# EasyEDA Pro project ProDoc_MSP-LITO-G3507.epro

# Schematic Schematic1
Board Name: MSP-LITO-G3507; Create Date: 2025-07-21; Page Name: P1; Project Name: NUEDC TI-2025 Ctrller Pltform; Schematic Name: Schematic1; Update Date: 2025-07-24; Company: CQUPT; Drawed: WilliTourt; Page Size: A3; Reviewed: WilliTourt; Version: V1.0
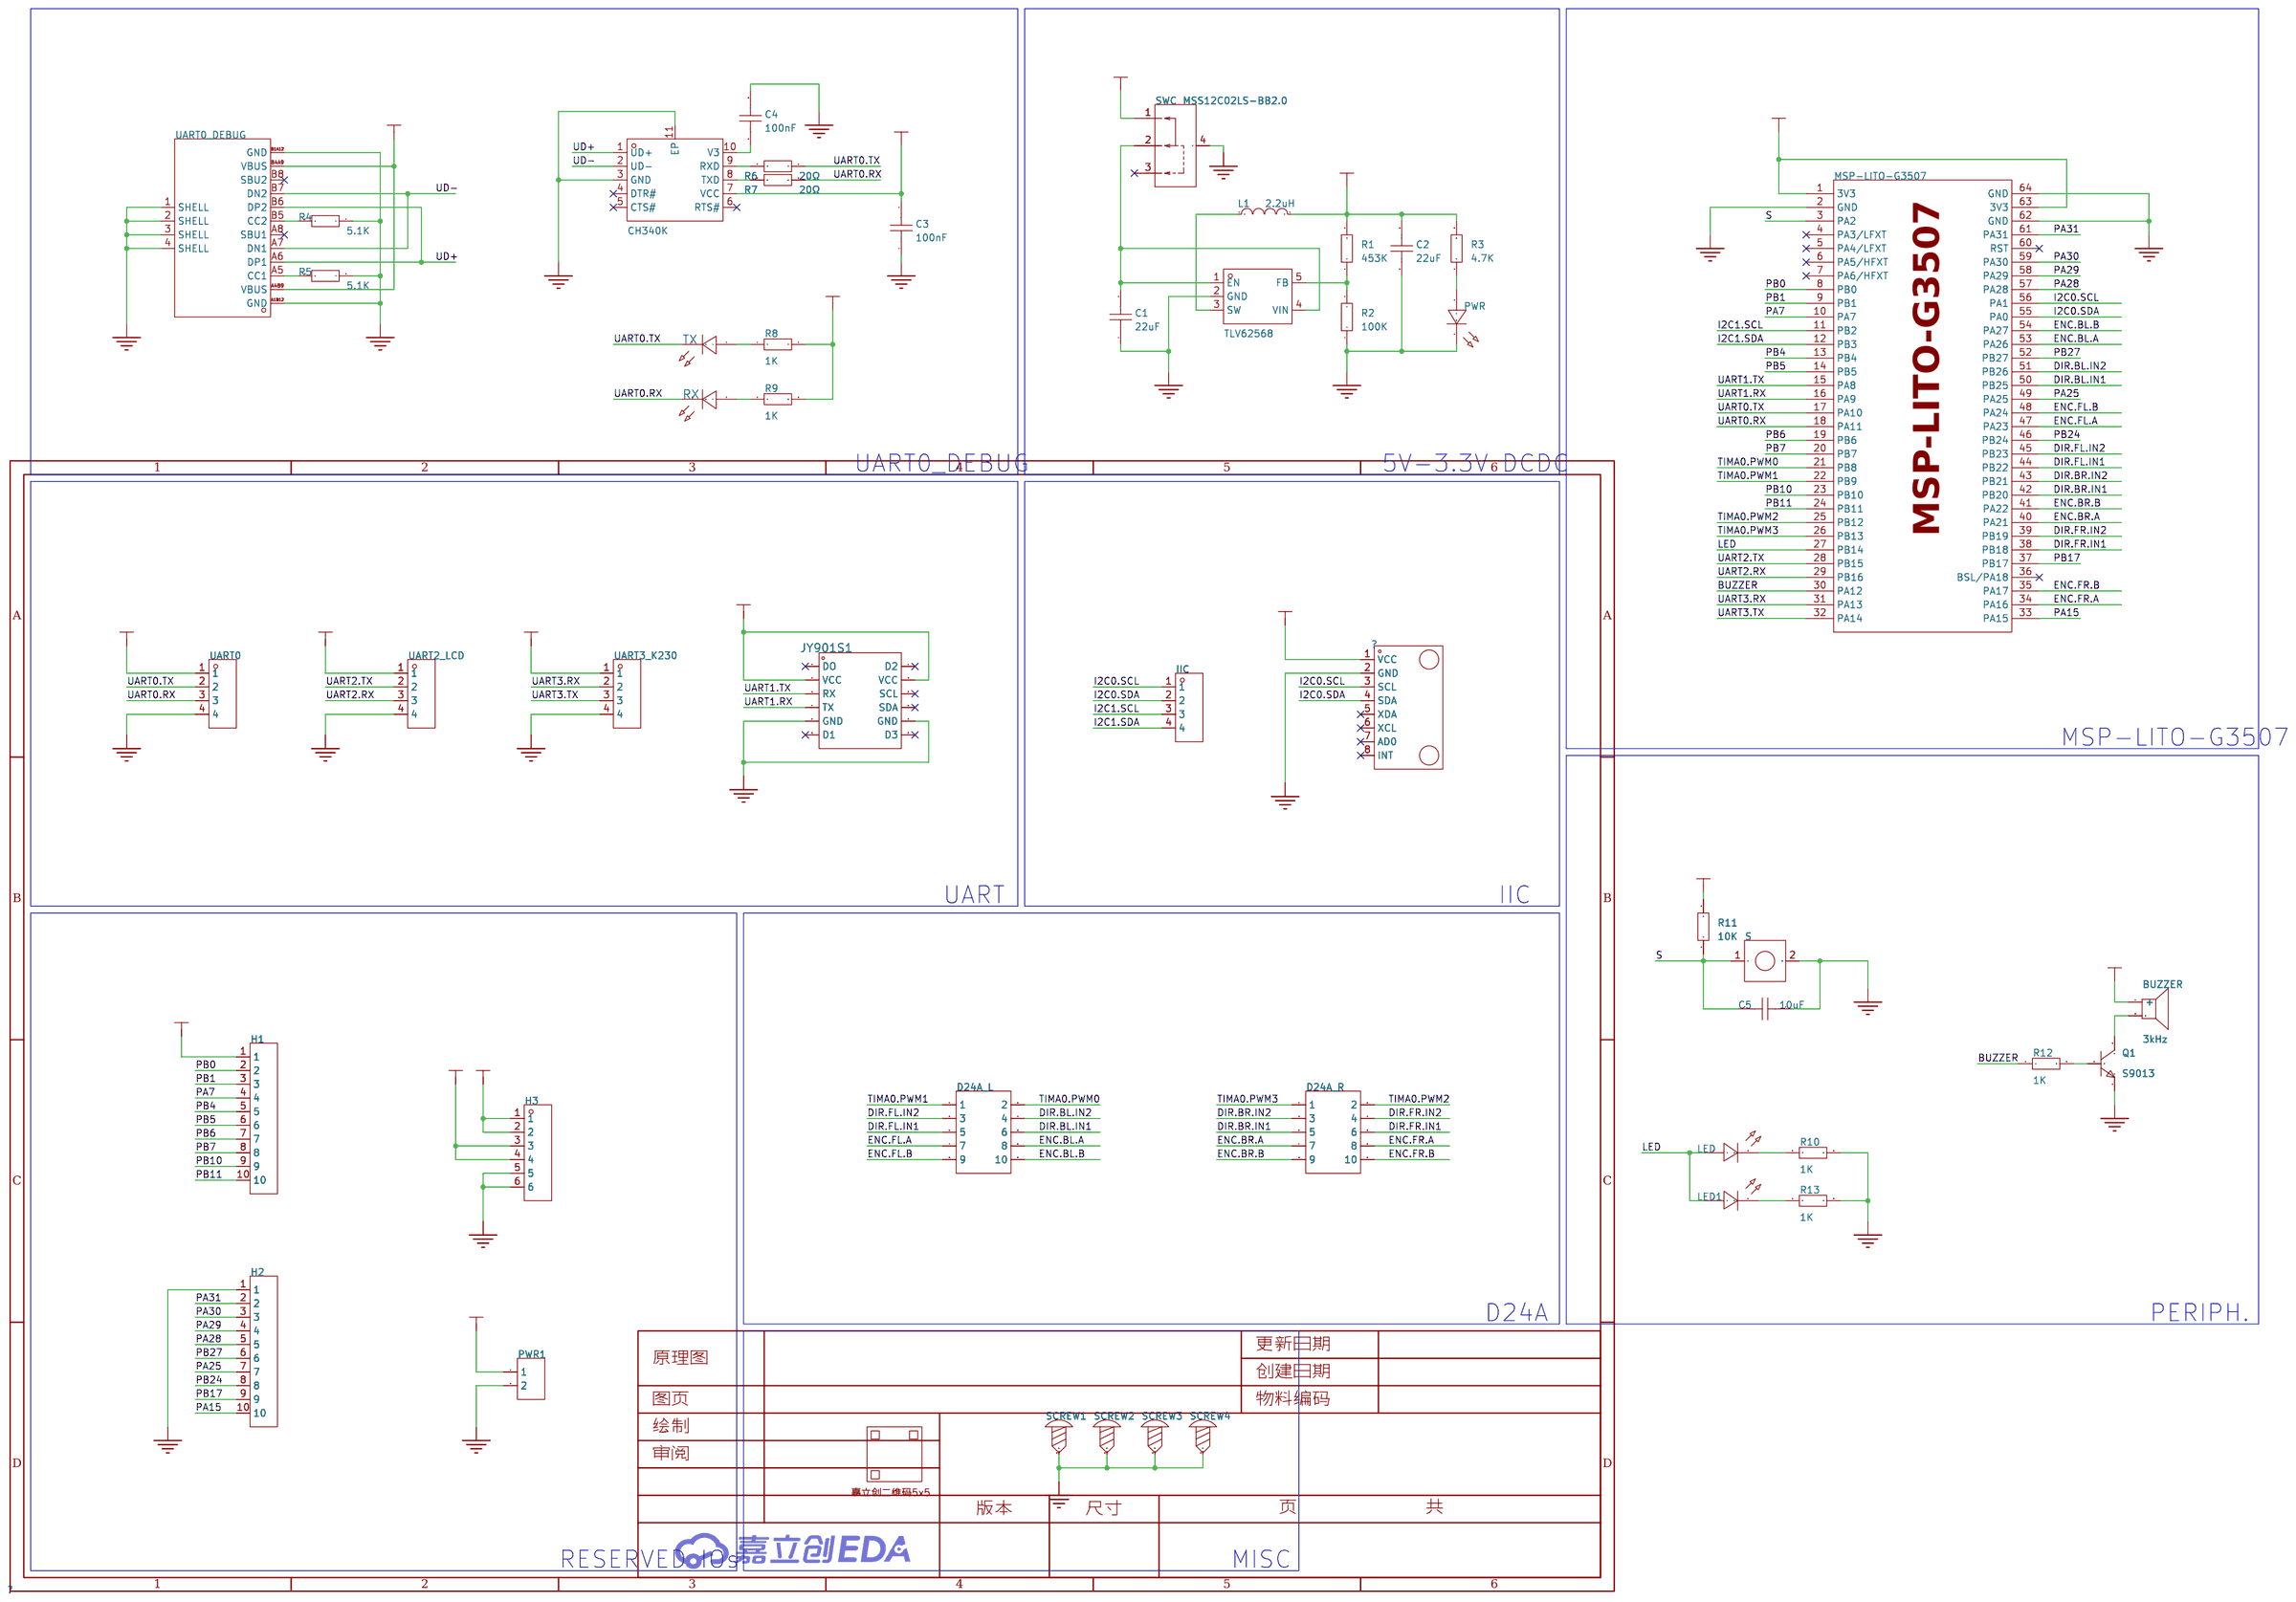
[diagram p0: schematic sheet]

## Parts
BUZZER  3kHz  [BUZ-SMD_L9.6-W9.6-LS10.0-R]
C1  22uF  [C0603]
C2  22uF  [C0603]
C3  100nF  [C0603]
C4  100nF  [C0603]
C5  10uF  [C0603]
CH340K  CH340K  [ESOP-10_L4.9-W3.9-P1.00-LS6.2-BL-EP]
D24A_L  -  [HDR-TH_10P-P2.54-V-F-R2-C5-S2.54]
D24A_R  -  [HDR-TH_10P-P2.54-V-F-R2-C5-S2.54]
H1  -  [HDR-TH_10P-P2.54-V-F]
H2  -  [HDR-TH_10P-P2.54-V-F]
H3  -  [HDR-TH_6P-P2.54-V-F]
IIC  -  [HDR-TH_4P-P2.54-V-F]
JY901S1  -  [JY901S]
L1  2.2uH  [IND-SMD_L3.0-W3.0_FNR30XXS]
LED  -  [LED0603]
LED1  -  [LED0603]
MPU6050  -  [MPU6050]
MSP-LITO-G3507  -  [MSP-LITO-G3507]
PWR  -  [LED0603]
PWR1  -  [HDR-TH_2P-P2.54-V-F]
Q1  S9013  [SOT-23-3_L2.9-W1.4-P1.90-LS2.6-BR]
QR  -  [JLC-QRCODE-5x5]
R1  453K  [R0603]
R2  100K  [R0603]
R3  4.7K  [R0603]
R4  5.1K  [R0603]
R5  5.1K  [R0603]
R6  20Ω  [R0603]
R7  20Ω  [R0603]
R8  1K  [R0603]
R9  1K  [R0603]
R10  1K  [R0603]
R11  10K  [R0603]
R12  1K  [R0603]
R13  1K  [R0603]
RX  -  [LED0603]
S  -  [6*6*5 硅胶开关]
SCREW1  -  [M3螺丝]
SCREW2  -  [M3螺丝]
SCREW3  -  [M3螺丝]
SCREW4  -  [M3螺丝]
SWC  MSS12C02LS-BB2.0  [SW-SMD_MSS12C02LS-HB2.0-1]
TLV62568  TLV62568DBVR  [SOT-23-5_L3.0-W1.7-P0.95-LS2.8-BR]
TX  -  [LED0603]
UART0  -  [HDR-TH_4P-P2.54-V-F]
UART0_DEBUG  Type-C-TOP_1  [USB-C-SMD_TYPE-C16PIN]
UART2_LCD  -  [HDR-TH_4P-P2.54-V-F]
UART3_K230  -  [HDR-TH_4P-P2.54-V-F]

## Library data of the parts
BUZZER = FUET-9650B-3V: 驱动方式:有源(内含驱动线路);构造类型:电磁式;频率:3kHz;声压(SPL):85dB;; LCSC Part Name: 电压 3V 频率 3KHZ; Supplier Part: C391032; Manufacturer: FUET(福声科技); Supplier Footprint: SMD,9.6x9.6mm; JLCPCB Part Class: 扩展库; Datasheet: https://atta.szlcsc.com/upload/public/pdf/source/20191031/C391032_DAAC75D3C9B9135EF0EA60697D179A21.pdf; Supplier: LCSC; Driver Circuitry: 有源(内含驱动线路); Technology: 电磁式; Voltage - Supply: 2V~5V; Sound Pressure Level(SPL): 85dB; Length: 9.6mm; Width: 9.6mm; Height: 5.5mm
C1-C5 = C0603: Supplier Footprint: 0603
CH340K = CH340K: 应用功能:USB转串口;接口协议:USB 2.0;通道数:-;数据速率:2Mbps;; LCSC Part Name: USB转串口芯片CH340; Supplier Part: C968586; Manufacturer: WCH(南京沁恒); Supplier Footprint: ESSOP-10-150mil-1mm; JLCPCB Part Class: 扩展库; Datasheet: https://atta.szlcsc.com/upload/public/pdf/source/20240313/C21A12AB66F63ABF8F8743FF13A35C95.pdf; Supplier: LCSC; Applications Function: USB转串口; Protocol: USB 2.0; Voltage - Supply: 3.3V；5V; Data Rate: 2Mbps; Operating Temperature: -20℃~+70℃
D24A_L D24A_R = HDR-F_2.54_2x5: Supplier Part: C92270; Supplier Footprint: 插件
H1 H2 = HDR-F_2.54_1x10P: Supplier Part: C2684744; Supplier Footprint: 插件
H3 = HDR-F_2.54_1x6P: Supplier Part: C40877; Supplier Footprint: 插件
IIC UART0 UART2_LCD UART3_K230 = HDR-F_2.54_1x4P: Supplier Part: C2718488; Supplier Footprint: 插件
JY901S1 = JY901S
L1 = FNR3015S2R2MT: 电感值:2.2uH;精度:±20%;额定电流:2A;饱和电流(Isat):2A;; LCSC Part Name: 2.2uH ±20% 2A; Supplier Part: C167747; Manufacturer: cjiang(长江微电); Supplier Footprint: SMD,3x3mm; JLCPCB Part Class: 扩展库; Datasheet: https://atta.szlcsc.com/upload/public/pdf/source/20190327/C167925_9EFF0AABC4CA629C2CC95961DBF7D39D.pdf; Supplier: LCSC; Tolerance: ±20%; Rated Current: 2A; Saturation Current (Isat): 2A; DC Resistance (DCR): 78mΩ
LED LED1 = LED0603-WHITE
MPU6050 = MPU6050
MSP-LITO-G3507 = MSP-LITO-G3507
PWR = LED0603-GREEN
PWR1 = HDR-F_2.54_1x2P: Supplier Part: C49661; Supplier Footprint: 插件
Q1 = S9013_C2836092: 晶体管类型:NPN;集电极电流(Ic):500mA;集射极击穿电压(Vceo):25V;功率(Pd):300mW;直流电流增益(hFE@Ic,Vce):120@50mA,1V;; LCSC Part Name: J3(J3表示丝印); Supplier Part: C2836092; Manufacturer: CBI(创基); Supplier Footprint: SOT-23; JLCPCB Part Class: 扩展库; Datasheet: https://atta.szlcsc.com/upload/public/pdf/source/20210621/C2836092_15188A6897D44309F7F2A6D715C57DA2.pdf; Supplier: LCSC; Transistor Type: NPN; Collector Current (Ic): 500mA; Collector-Emitter Breakdown Voltage (Vceo): 25V; Power Dissipation (Pd): 300mW; DC Current Gain (hFE@Ic,Vce): 120@50mA,1V; Transition Frequency (fT): 150MHz; Collector Cut-Off Current (Icbo): 100nA; Collector-Emitter Saturation Voltage (VCE(sat)@Ic,Ib): 600mV@500mA,50mA
QR = 嘉立创二维码5x5
R1-R13 = R0603: Supplier Footprint: 0603
RX TX = LED0603-ORANGE: Supplier Footprint: 0603
S = 6*6*5 硅胶开关
SCREW1-SCREW4 = M3螺丝: Supplier Footprint: 插件
SWC = MSS12C02LS-BB2.0: 电路结构:单刀双掷;安装方式:立贴;开关颜色:-;额定电流(DC):100mA;额定电压(DC):12V;额定电流(AC):-;额定电压(AC):-;机械寿命:1万次;; Supplier Part: C3008585; Manufacturer: SHOU HAN(首韩); Supplier Footprint: SMD; JLCPCB Part Class: 扩展库; Datasheet: https://atta.szlcsc.com/upload/public/pdf/source/20220429/8AEFBC67104491914BC5659DE1F359A3.pdf; Supplier: LCSC; Circuit: 单刀双掷; Pin Style: SMD接片; Switch Length: 6.65mm; Switch Width: 2.75mm; Switch Height: 1.4mm; Mounting Style: 立贴; Current Rating (DC): 100mA; Voltage Rating (DC): 12V; Mechanical Life: 1万次; Operating Temperature: -25℃~+70℃
TLV62568 = TLV62568DBVR: 功能类型:降压型;输出类型:可调;工作电压:2.5V~5.5V;输出电压:600mV~5.5V;输出电流:1A;; LCSC Part Name: 1A高效同步降压转换器; Supplier Part: C163219; Manufacturer: TI(德州仪器); Supplier Footprint: SOT-23-5; JLCPCB Part Class: 扩展库; Datasheet: https://www.ti.com/cn/lit/gpn/tlv62568; Supplier: LCSC; Function: 降压型; Output Type: 可调; Input Voltage: 2.5V~5.5V; Output Voltage: 600mV~5.5V; Output Current: 1A; Switching Frequency: 1.5MHz; Operating Temperature: -40℃~+125℃@(TJ); Synchronous Rectification: 是; Number of Outputs: 1; Topology: 降压式; Switch tube (built-in/external): 内置
UART0_DEBUG = Type-C-TOP_1: Supplier Part: C9900005857; Supplier Footprint: Type-C16P; JLCPCB Part Class: 扩展库; Supplier: LCSC; Check: false

## Nets
3V3: BUZZER.1(+) C2.2 C3.2 CH340K.7(VCC) H1.1 H3.3 H3.4 JY901S1.2(VCC) JY901S1.8(VCC) L1.2 MPU6050.1(VCC) MSP-LITO-G3507.1(3V3) MSP-LITO-G3507.63(3V3) R1.2 R3.2 R8.2 R9.2 R11.2 UART0.1 UART2_LCD.1 UART3_K230.1
5V: H3.1 H3.2 PWR1.1 SWC.1 UART0_DEBUG.A4B9(VBUS) UART0_DEBUG.B4A9(VBUS)
GND: C1.1 C2.1 C3.1 C4.2 C5.1 CH340K.3(GND) CH340K.11(EP) H2.1 H3.5 H3.6 JY901S1.5(GND) JY901S1.11(GND) MPU6050.2(GND) MSP-LITO-G3507.2(GND) MSP-LITO-G3507.62(GND) MSP-LITO-G3507.64(GND) PWR.1(C) PWR1.2 Q1.2(E) R2.1 R4.1 R5.1 R10.2 R13.2 S.2 SCREW1.1 SCREW2.1 SCREW3.1 SCREW4.1 SWC.4 TLV62568.2(GND) UART0.4 UART0_DEBUG.1(SHELL) UART0_DEBUG.2(SHELL) UART0_DEBUG.3(SHELL) UART0_DEBUG.4(SHELL) UART0_DEBUG.A1B12(GND) UART0_DEBUG.B1A12(GND) UART2_LCD.4 UART3_K230.4
BUZZER: MSP-LITO-G3507.30(PA12) R12.1
DIR.BL.IN1: D24A_L.6 MSP-LITO-G3507.50(PB25)
DIR.BL.IN2: D24A_L.4 MSP-LITO-G3507.51(PB26)
DIR.BR.IN1: D24A_R.5 MSP-LITO-G3507.42(PB20)
DIR.BR.IN2: D24A_R.3 MSP-LITO-G3507.43(PB21)
DIR.FL.IN1: D24A_L.5 MSP-LITO-G3507.44(PB22)
DIR.FL.IN2: D24A_L.3 MSP-LITO-G3507.45(PB23)
DIR.FR.IN1: D24A_R.6 MSP-LITO-G3507.38(PB18)
DIR.FR.IN2: D24A_R.4 MSP-LITO-G3507.39(PB19)
ENC.BL.A: D24A_L.8 MSP-LITO-G3507.53(PA26)
ENC.BL.B: D24A_L.10 MSP-LITO-G3507.54(PA27)
ENC.BR.A: D24A_R.7 MSP-LITO-G3507.40(PA21)
ENC.BR.B: D24A_R.9 MSP-LITO-G3507.41(PA22)
ENC.FL.A: D24A_L.7 MSP-LITO-G3507.47(PA23)
ENC.FL.B: D24A_L.9 MSP-LITO-G3507.48(PA24)
ENC.FR.A: D24A_R.8 MSP-LITO-G3507.34(PA16)
ENC.FR.B: D24A_R.10 MSP-LITO-G3507.35(PA17)
I2C0.SCL: IIC.1 MPU6050.3(SCL) MSP-LITO-G3507.56(PA1)
I2C0.SDA: IIC.2 MPU6050.4(SDA) MSP-LITO-G3507.55(PA0)
I2C1.SCL: IIC.3 MSP-LITO-G3507.11(PB2)
I2C1.SDA: IIC.4 MSP-LITO-G3507.12(PB3)
LED: LED.2(A) LED1.2(A) MSP-LITO-G3507.27(PB14)
PA7: H1.4 MSP-LITO-G3507.10(PA7)
PA15: H2.10 MSP-LITO-G3507.33(PA15)
PA25: H2.7 MSP-LITO-G3507.49(PA25)
PA28: H2.5 MSP-LITO-G3507.57(PA28)
PA29: H2.4 MSP-LITO-G3507.58(PA29)
PA30: H2.3 MSP-LITO-G3507.59(PA30)
PA31: H2.2 MSP-LITO-G3507.61(PA31)
PB0: H1.2 MSP-LITO-G3507.8(PB0)
PB1: H1.3 MSP-LITO-G3507.9(PB1)
PB4: H1.5 MSP-LITO-G3507.13(PB4)
PB5: H1.6 MSP-LITO-G3507.14(PB5)
PB6: H1.7 MSP-LITO-G3507.19(PB6)
PB7: H1.8 MSP-LITO-G3507.20(PB7)
PB10: H1.9 MSP-LITO-G3507.23(PB10)
PB11: H1.10 MSP-LITO-G3507.24(PB11)
PB17: H2.9 MSP-LITO-G3507.37(PB17)
PB24: H2.8 MSP-LITO-G3507.46(PB24)
PB27: H2.6 MSP-LITO-G3507.52(PB27)
S: C5.2 MSP-LITO-G3507.3(PA2) R11.1 S.1
TIMA0.PWM0: D24A_L.2 MSP-LITO-G3507.21(PB8)
TIMA0.PWM1: D24A_L.1 MSP-LITO-G3507.22(PB9)
TIMA0.PWM2: D24A_R.2 MSP-LITO-G3507.25(PB12)
TIMA0.PWM3: D24A_R.1 MSP-LITO-G3507.26(PB13)
UART0.RX: MSP-LITO-G3507.18(PA11) R7.1 RX.1(C) UART0.3
UART0.TX: MSP-LITO-G3507.17(PA10) R6.1 TX.1(C) UART0.2
UART1.RX: JY901S1.4(TX) MSP-LITO-G3507.16(PA9)
UART1.TX: JY901S1.3(RX) MSP-LITO-G3507.15(PA8)
UART2.RX: MSP-LITO-G3507.29(PB16) UART2_LCD.3
UART2.TX: MSP-LITO-G3507.28(PB15) UART2_LCD.2
UART3.RX: MSP-LITO-G3507.31(PA13) UART3_K230.2
UART3.TX: MSP-LITO-G3507.32(PA14) UART3_K230.3
UD+: CH340K.1(UD+) UART0_DEBUG.A6(DP1) UART0_DEBUG.B6(DP2)
UD-: CH340K.2(UD-) UART0_DEBUG.A7(DN1) UART0_DEBUG.B7(DN2)
$1N5901: CH340K.9(RXD) R6.2
$1N5929: CH340K.8(TXD) R7.2
$1N6046: C4.1 CH340K.10(V3)
$1N7360: Q1.1(B) R12.2
$1N7363: BUZZER.2 Q1.3(C)
$1N7370: LED.1(C) R10.1
$1N18211: LED1.1(C) R13.1
Net-(C1-2): C1.2 SWC.2 TLV62568.1(EN) TLV62568.4(VIN)
Net-(L1-1): L1.1 TLV62568.3(SW)
Net-(PWR-2): PWR.2(A) R3.1
Net-(R1-1): R1.1 R2.2 TLV62568.5(FB)
Net-(R4-2): R4.2 UART0_DEBUG.B5(CC2)
Net-(R5-2): R5.2 UART0_DEBUG.A5(CC1)
Net-(R8-1): R8.1 TX.2(A)
Net-(R9-1): R9.1 RX.2(A)

Not connected (* = marked no-connect by the designer): CH340K 4(DTR#)* 5(CTS#)* 6(RTS#)*; JY901S1 1(DO)* 6(D1)* 7(D2)* 9(SCL)* 10(SDA)* 12(D3)*; MPU6050 5(XDA)* 6(XCL)* 7(AD0)* 8(INT)*; MSP-LITO-G3507 4(PA3/LFXT)* 5(PA4/LFXT)* 6(PA5/HFXT)* 7(PA6/HFXT)* 36(BSL/PA18)* 60(RST)*; SWC 3*; UART0_DEBUG A8(SBU1)* B8(SBU2)*

## Notes on the sheet
- UART0_DEBUG
- 5V-3.3V DCDC
- MSP-LITO-G3507
- UART
- IIC
- D24A
- PERIPH.
- RESERVED IOs
- MISC

# Board PCB1
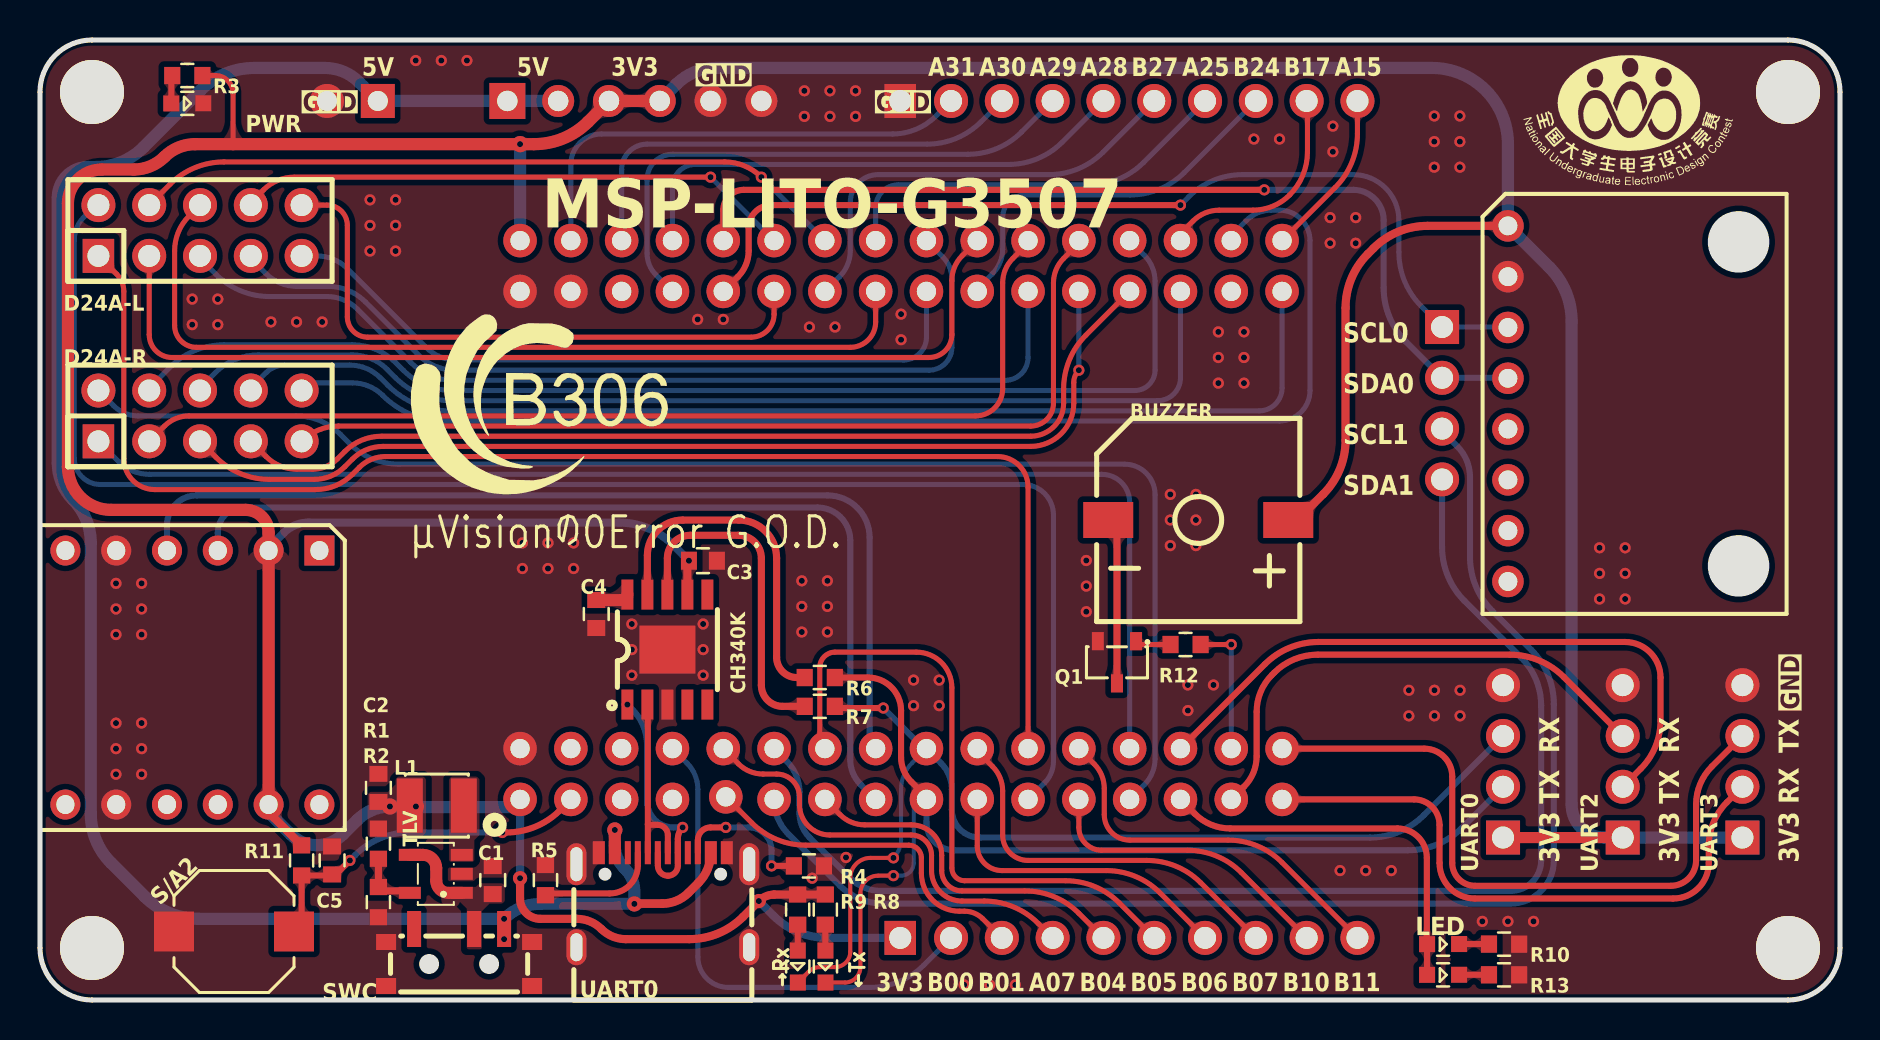
[diagram p1: board, top side]
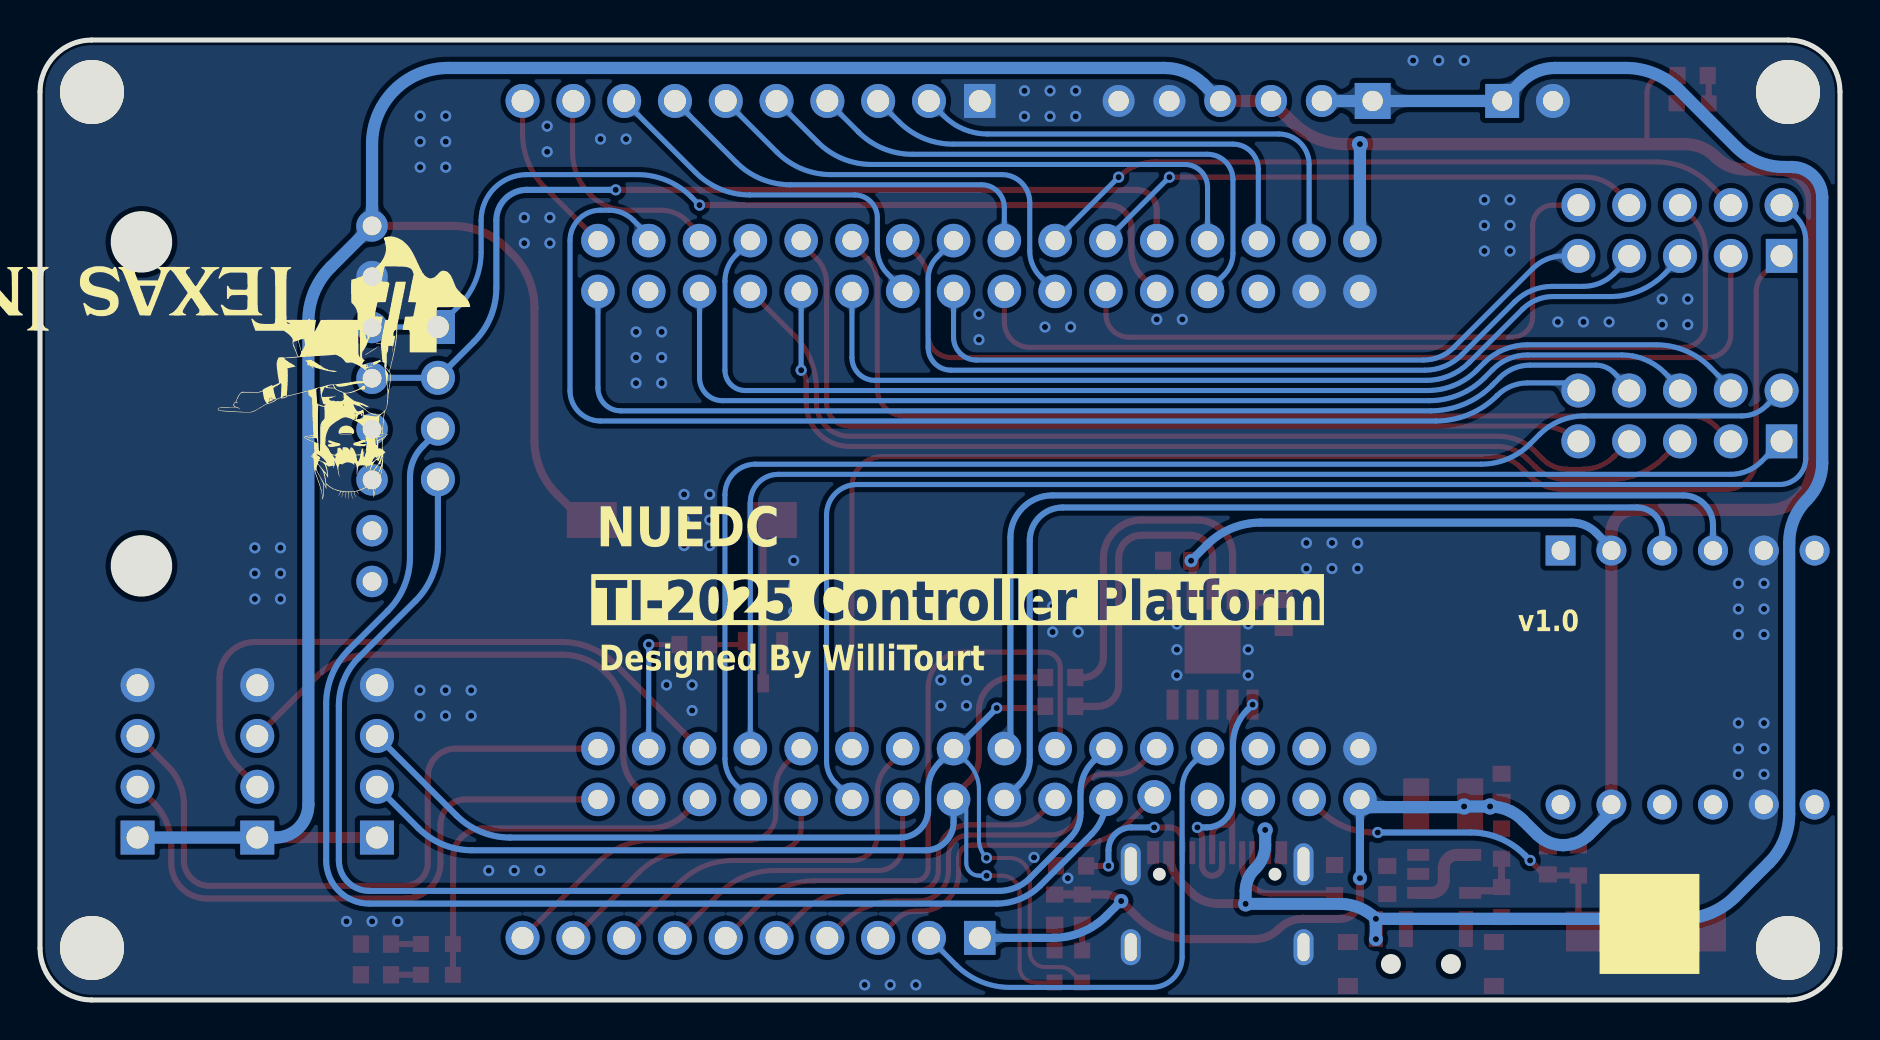
[diagram p2: board, bottom side, seen from below]

Outline 90 x 48 mm; copper layers: Top Layer, Bottom Layer. Coordinates in mm from the lower left corner of the outline.
Outline path: 0,45.4 0,2.6 arc(0.76,0.76) 2.6,0 87.4,0 arc(89.24,0.76) 90,2.6 90,45.4 arc(89.24,47.24) 87.4,48 2.6,48 arc(0.76,47.24) 0,45.4
Stack: Top Layer 0.035mm / Dielectric1 1.51mm FR4 er 4.5 / Bottom Layer 0.035mm

## Design rules (mm)
template: 自定义配置
spacing copperThickness1oz (default): track to track 0.102, other pairs 0.152 to 0.3
spacing copperThickness2oz: track to track 0.203, other pairs 0.152 to 0.3
track width copperThickness1oz (default): min 0.127, default 0.254, max 2.54
track width copperThickness2oz: min 0.203, default 0.254, max 2.54
differential pair differentialPair (default): width min 0.127, default 0.254, max 2.54; gap min 0.152, default 0.152
via viaSize (default): diameter min 0.5, default 0.61, max 10; hole min 0.3, default 0.305, max 6.3

## Placement (name value [footprint] x y rotation side)
BUZZER  3kHz  [BUZ-SMD_L9.6-W9.6-LS10.0-R]  57.91 24 0 top
C1  22uF  [C0603]  22.64 6 270 top
C2  22uF  [C0603]  16.92 10.61 270 top
C3  100nF  [C0603]  33.15 21.97 180 top
C4  100nF  [C0603]  27.81 19.3 270 top
C5  10uF  [C0603]  14.61 6.98 270 top
CH340K  CH340K  [ESOP-10_L4.9-W3.9-P1.00-LS6.2-BL-EP]  31.37 17.52 0 top
D24A-L  -  [HDR-TH_10P-P2.54-V-F-R2-C5-S2.54]  8 38.47 0 top
D24A-R  -  [HDR-TH_10P-P2.54-V-F-R2-C5-S2.54]  8 29.2 0 top
H1  -  [HDR-TH_10P-P2.54-V-F]  54.44 3.11 0 top
H2  -  [HDR-TH_10P-P2.54-V-F]  54.44 44.95 0 top
H3  -  [HDR-TH_6P-P2.54-V-F]  29.72 44.95 0 top
IIC  -  [HDR-TH_4P-P2.54-V-F]  70.1 29.84 270 top
JY901S  -  [JY901S]  7.62 16.12 270 top
L1  2.2uH  [IND-SMD_L3.0-W3.0_FNR30XXS]  19.84 9.72 0 top
LED  -  [LED0603]  70.1 2.79 180 top
LED1  -  [LED0603]  70.1 1.25 180 top
MPU6050  -  [MPU6050]  72.13 40.31 0 top
MSP-LITO-G3507  -  [MSP-LITO-G3507]  43.05 24 90 top
PWR  -  [HDR-TH_2P-P2.54-V-F]  15.62 44.95 180 top
PWR#2  -  [LED0603]  7.31 44.83 180 top
Q1  S9013  [SOT-23-3_L2.9-W1.4-P1.90-LS2.6-BR]  53.85 16.89 90 top
QR  -  [JLC-QRCODE-5x5]  9.53 3.8 180 bottom
R1  453K  [R0603]  16.92 7.81 90 top
R2  100K  [R0603]  16.92 4.89 90 top
R3  4.7K  [R0603]  7.37 46.22 0 top
R4  5.1K  [R0603]  38.45 6.7 180 top
R5  5.1K  [R0603]  25.27 6 270 top
R6  20Ω  [R0603]  38.99 16.12 180 top
R7  20Ω  [R0603]  38.99 14.68 180 top
R8  1K  [R0603]  39.26 4.52 90 top
R9  1K  [R0603]  37.88 4.52 90 top
R10  1K  [R0603]  73.2 2.79 0 top
R11  10K  [R0603]  13.08 6.98 90 top
R12  1K  [R0603]  57.28 17.77 180 top
R13  1K  [R0603]  73.2 1.26 0 top
S/A2  -  [6*6*5 硅胶开关]  12.7 0.38 180 top
SCREW1  -  [M3螺丝]  2.6 45.4 0 top
SCREW2  -  [M3螺丝]  2.6 2.6 0 top
SCREW3  -  [M3螺丝]  87.4 2.6 0 top
SCREW4  -  [M3螺丝]  87.4 45.4 0 top
SWC  MSS12C02LS-BB2.0  [SW-SMD_MSS12C02LS-HB2.0-1]  20.95 2.12 180 top
TLV  TLV62568DBVR  [SOT-23-5_L3.0-W1.7-P0.95-LS2.8-BR]  19.79 6.31 0 top
UART0  -  [USB-C-SMD_TYPE-C16PIN]  31.14 5 0 top
UART0#2  -  [HDR-TH_4P-P2.54-V-F]  73.15 11.93 90 top
UART2  -  [HDR-TH_4P-P2.54-V-F]  79.14 11.93 90 top
UART3  -  [HDR-TH_4P-P2.54-V-F]  85.12 11.93 90 top
←Tx  -  [LED0603]  39.26 1.72 90 top
→Rx  -  [LED0603]  37.88 1.72 90 top

## Footprints (pads in the part's own frame, mm; a bottom-side part is the same pattern mirrored in y, then rotated)
6*6*5 硅胶开关
  rect 2x2 smd: 1(0,-3.05) 2(6,-3.05)
BUZ-SMD_L9.6-W9.6-LS10.0-R
  rect 2.5x1.8 smd: 1(4.5,0) 2(-4.5,0)
C0603
  rect 0.8x0.9 smd: 1(-0.7,0) 2(0.7,0)
ESOP-10_L4.9-W3.9-P1.00-LS6.2-BL-EP
  rect 0.6x1.5 smd: 1(-2,-2.75) 2(-1,-2.75) 3(0,-2.75) 4(1,-2.75) 5(2,-2.75) 6(2,2.75) 7(1,2.75) 8(0,2.75) 9(-1,2.75) 10(-2,2.75)
  rect 2.8x2.4 smd: 11(0,0)
HDR-TH_2P-P2.54-V-F
  rect 1.7x1.7 hole 1: 1(-1.27,0)
  round 1.7 hole 1: 2(1.27,0)
HDR-TH_4P-P2.54-V-F
  rect 1.7x1.7 hole 1.1: 1(-3.81,0)
  round 1.7 hole 1.1: 2(-1.27,0) 3(1.27,0) 4(3.81,0)
HDR-TH_6P-P2.54-V-F
  rect 1.8x1.8 hole 1.02: 1(-6.35,0)
  round 1.6 hole 1.02: 2(-3.81,0) 3(-1.27,0) 4(1.27,0) 5(3.81,0) 6(6.35,0)
HDR-TH_10P-P2.54-V-F
  rect 1.575x1.7 hole 1.1: 1(-11.43,0)
  round 1.7 hole 1.1: 2(-8.89,0) 3(-6.35,0) 4(-3.81,0) 5(-1.27,0) 6(1.27,0) 7(3.81,0) 8(6.35,0) 9(8.89,0) 10(11.43,0)
HDR-TH_10P-P2.54-V-F-R2-C5-S2.54
  rect 1.575x1.7 hole 1.1: 1(-5.08,-1.27)
  round 1.7 hole 1.1: 2(-5.08,1.27) 3(-2.54,-1.27) 4(-2.54,1.27) 5(0,-1.27) 6(0,1.27) 7(2.54,-1.27) 8(2.54,1.27) 9(5.08,-1.27) 10(5.08,1.27)
IND-SMD_L3.0-W3.0_FNR30XXS
  rect 1.3x2.72 smd: 1(1.35,0) 2(-1.35,0)
JY901S
  rect 1.501x1.501 hole 0.945x0.899: 1(-6.35,6.35)
  round 1.501 hole 0.945x0.899: 2(-6.35,3.81) 3(-6.35,1.27) 4(-6.35,-1.27) 5(-6.35,-3.81) 6(-6.35,-6.35) 7(6.35,6.35) 8(6.35,3.81) 9(6.35,1.27) 10(6.35,-1.27) 11(6.35,-3.81) 12(6.35,-6.35)
LED0603
  rect 0.8x0.8 smd: 1(-0.851,-0.01) 2(0.75,-0.005)
M3螺丝
  round 3.2 hole 3.2: 1(0,0)
MPU6050
  round 1.575 hole 0.94: 1(1.27,-1.6) 2(1.27,-4.14) 3(1.27,-6.68) 4(1.27,-9.22) 5(1.27,-11.76) 6(1.27,-14.3) 7(1.27,-16.84) 8(1.27,-19.38)
MSP-LITO-G3507
  round 1.677 hole 0.965: 1(-13.97,19.05) 2(-11.43,19.05) 3(-13.97,16.51) 4(-11.43,16.51) 5(-13.97,13.97) 6(-11.43,13.97) 7(-13.97,11.43) 8(-11.43,11.43) 9(-13.843,8.763) 10(-11.43,8.89) 11(-13.97,6.35) 12(-11.43,6.35) 13(-13.97,3.81) 14(-11.43,3.81) 15(-13.97,1.27) 16(-11.43,1.27) 17(-13.97,-1.27) 18(-11.43,-1.27) 19(-13.97,-3.81) 20(-11.43,-3.81) 21(-13.97,-6.35) 22(-11.43,-6.35) 23(-13.97,-8.89) 24(-11.43,-8.89) 25(-13.97,-11.43) 26(-11.43,-11.43) 27(-13.97,-13.97) 28(-11.43,-13.97) 29(-13.97,-16.51) 30(-11.43,-16.51) 31(-13.97,-19.05) 32(-11.43,-19.05) 33(13.97,-19.05) 34(11.43,-19.05) 35(13.97,-16.51) 36(11.43,-16.51) 37(13.97,-13.97) 38(11.43,-13.97) 39(13.97,-11.43) 40(11.43,-11.43) 41(13.97,-8.89) 42(11.43,-8.89) 43(13.97,-6.35) 44(11.43,-6.35) 45(13.97,-3.81) 46(11.43,-3.81) 47(13.97,-1.27) 48(11.43,-1.27) 49(13.97,1.27) 50(11.43,1.27) 51(13.97,3.81) 52(11.43,3.81) 53(13.97,6.35) 54(11.43,6.35) 55(13.97,8.89) 56(11.43,8.89) 57(13.97,11.43) 58(11.43,11.43) 59(13.97,13.97) 60(11.43,13.97) 61(13.97,16.51) 62(11.43,16.51) 63(13.97,19.05) 64(11.43,19.05)
R0603
  rect 0.806x0.864 smd: 1(-0.753,0) 2(0.753,0)
SOT-23-3_L2.9-W1.4-P1.90-LS2.6-BR
  rect 0.91x0.6 smd: 1(1.055,-0.955) 2(1.055,0.955) 3(-1.055,0)
SOT-23-5_L3.0-W1.7-P0.95-LS2.8-BR
  rect 1.1x0.6 smd: 1(1.3,-0.95) 2(1.3,0) 3(1.3,0.95) 4(-1.3,0.95) 5(-1.3,-0.95)
SW-SMD_MSS12C02LS-HB2.0-1
  rect 0.7x1.8 smd: 1(-2.25,-1.425) 2(-0.75,-1.425) 3(2.25,-1.425)
  rect 1x0.8 smd: 4(-3.65,1.425) 4(-3.65,-0.775) 4(3.65,1.425) 4(3.65,-0.775)
USB-C-SMD_TYPE-C16PIN
  oval 1x2.1 hole 0.6x1.7: 1(-4.32,1.788) 2(4.32,1.788)
  oval 1x1.8 hole 0.6x1.4: 3(-4.32,-2.362) 4(4.32,-2.362)
  rect 0.6x1.15 smd: A1B12(-3.2,2.362) A4B9(-2.4,2.362) B1A12(3.2,2.362) B4A9(2.4,2.362)
  rect 0.3x1.15 smd: A5(-1.25,2.362) A6(-0.25,2.362) A7(0.25,2.362) A8(1.25,2.362) B5(1.75,2.362) B6(0.75,2.362) B7(-0.75,2.362) B8(-1.75,2.362)

## Nets
3V3: BUZZER.1 C2.2 C3.2 CH340K.7 H1.1 H3.3 H3.4 JY901S.2 JY901S.8 L1.2 MPU6050.1 MSP-LITO-G3507.1 MSP-LITO-G3507.63 R1.2 R3.2 R8.2 R9.2 R11.2 UART0#2.1 UART2.1 UART3.1
5V: H3.1 H3.2 PWR.1 SWC.1 UART0.A4B9 UART0.B4A9
GND: C1.1 C2.1 C3.1 C4.2 C5.1 CH340K.3 CH340K.11 H2.1 H3.5 H3.6 JY901S.5 JY901S.11 MPU6050.2 MSP-LITO-G3507.2 MSP-LITO-G3507.62 MSP-LITO-G3507.64 PWR.2 PWR#2.1 Q1.2 R2.1 R4.1 R5.1 R10.2 R13.2 S/A2.2 SCREW1.1 SCREW2.1 SCREW3.1 SCREW4.1 SWC.4 TLV.2 UART0.1 UART0.2 UART0.3 UART0.4 UART0.A1B12 UART0.B1A12 UART0#2.4 UART2.4 UART3.4
BUZZER: MSP-LITO-G3507.30 R12.1
DIR.BL.IN1: D24A-L.6 MSP-LITO-G3507.50
DIR.BL.IN2: D24A-L.4 MSP-LITO-G3507.51
DIR.BR.IN1: D24A-R.5 MSP-LITO-G3507.42
DIR.BR.IN2: D24A-R.3 MSP-LITO-G3507.43
DIR.FL.IN1: D24A-L.5 MSP-LITO-G3507.44
DIR.FL.IN2: D24A-L.3 MSP-LITO-G3507.45
DIR.FR.IN1: D24A-R.6 MSP-LITO-G3507.38
DIR.FR.IN2: D24A-R.4 MSP-LITO-G3507.39
ENC.BL.A: D24A-L.8 MSP-LITO-G3507.53
ENC.BL.B: D24A-L.10 MSP-LITO-G3507.54
ENC.BR.A: D24A-R.7 MSP-LITO-G3507.40
ENC.BR.B: D24A-R.9 MSP-LITO-G3507.41
ENC.FL.A: D24A-L.7 MSP-LITO-G3507.47
ENC.FL.B: D24A-L.9 MSP-LITO-G3507.48
ENC.FR.A: D24A-R.8 MSP-LITO-G3507.34
ENC.FR.B: D24A-R.10 MSP-LITO-G3507.35
I2C0.SCL: IIC.1 MPU6050.3 MSP-LITO-G3507.56
I2C0.SDA: IIC.2 MPU6050.4 MSP-LITO-G3507.55
I2C1.SCL: IIC.3 MSP-LITO-G3507.11
I2C1.SDA: IIC.4 MSP-LITO-G3507.12
LED: LED.2 LED1.2 MSP-LITO-G3507.27
PA7: H1.4 MSP-LITO-G3507.10
PA15: H2.10 MSP-LITO-G3507.33
PA25: H2.7 MSP-LITO-G3507.49
PA28: H2.5 MSP-LITO-G3507.57
PA29: H2.4 MSP-LITO-G3507.58
PA30: H2.3 MSP-LITO-G3507.59
PA31: H2.2 MSP-LITO-G3507.61
PB0: H1.2 MSP-LITO-G3507.8
PB1: H1.3 MSP-LITO-G3507.9
PB4: H1.5 MSP-LITO-G3507.13
PB5: H1.6 MSP-LITO-G3507.14
PB6: H1.7 MSP-LITO-G3507.19
PB7: H1.8 MSP-LITO-G3507.20
PB10: H1.9 MSP-LITO-G3507.23
PB11: H1.10 MSP-LITO-G3507.24
PB17: H2.9 MSP-LITO-G3507.37
PB24: H2.8 MSP-LITO-G3507.46
PB27: H2.6 MSP-LITO-G3507.52
S: C5.2 MSP-LITO-G3507.3 R11.1 S/A2.1
TIMA0.PWM0: D24A-L.2 MSP-LITO-G3507.21
TIMA0.PWM1: D24A-L.1 MSP-LITO-G3507.22
TIMA0.PWM2: D24A-R.2 MSP-LITO-G3507.25
TIMA0.PWM3: D24A-R.1 MSP-LITO-G3507.26
UART0.RX: MSP-LITO-G3507.18 R7.1 UART0#2.3 →Rx.1
UART0.TX: MSP-LITO-G3507.17 R6.1 UART0#2.2 ←Tx.1
UART1.RX: JY901S.4 MSP-LITO-G3507.16
UART1.TX: JY901S.3 MSP-LITO-G3507.15
UART2.RX: MSP-LITO-G3507.29 UART2.3
UART2.TX: MSP-LITO-G3507.28 UART2.2
UART3.RX: MSP-LITO-G3507.31 UART3.2
UART3.TX: MSP-LITO-G3507.32 UART3.3
UD+: CH340K.1 UART0.A6 UART0.B6
UD-: CH340K.2 UART0.A7 UART0.B7
$1N4920: L1.1 TLV.3
$1N4922: PWR#2.2 R3.1
$1N4923: R1.1 R2.2 TLV.5
$1N4924: C1.2 SWC.2 TLV.1 TLV.4
$1N5756: R4.2 UART0.B5
$1N5757: R5.2 UART0.A5
$1N5901: CH340K.9 R6.2
$1N5929: CH340K.8 R7.2
$1N6046: C4.1 CH340K.10
$1N7352: R9.1 →Rx.2
$1N7353: R8.1 ←Tx.2
$1N7360: Q1.1 R12.2
$1N7363: BUZZER.2 Q1.3
$1N7370: LED.1 R10.1
$1N18211: LED1.1 R13.1

Pads without a net: CH340K 4 5 6; JY901S 1 6 7 9 10 12; MPU6050 5 6 7 8; MSP-LITO-G3507 4 5 6 7 36 60; SWC 3; UART0 A8 B8

## Via types
v1: diameter 0.813, hole 0.305, Top Layer to Bottom Layer, 3 vias
v2: diameter 0.711, hole 0.305, Top Layer to Bottom Layer, 2 vias
v3: diameter 0.66, hole 0.305, Top Layer to Bottom Layer, 1 via
v4: diameter 0.559, hole 0.305, Top Layer to Bottom Layer, 132 vias
v5: diameter 0.762, hole 0.305, Top Layer to Bottom Layer, 2 vias
v6: diameter 0.701, hole 0.305, Top Layer to Bottom Layer, 2 vias

## Routing (per net, layer and track width the routed paths; a pad name or vN(x,y) marks a point on that pad's centre or on a via; arc(x,y) is an arc through that point)
3V3: length 267
  Top Layer w0.254: 9.65,42.79 9.65,45.33 arc(9.39,45.96) 8.76,46.22 R3.2
  Top Layer w0.406: v2(24,6.09) 24,5.07 arc(24.3,4.36) 25.02,4.06 26.84,4.06 arc(27.5,3.93) 28.07,3.55 arc(28.63,3.17) 29.29,3.04 32.46,3.04 arc(33.92,3.33) 35.15,4.16 v2(35.94,4.95) arc(36.28,5.18) 36.68,5.27 arc(36.7,5.27) 36.73,5.27 R9.2 R8.2 ; R11.2 11.71,9.11 arc(11.5,9.41) 11.43,9.77 ; CH340K.7 32.37,21.78 arc(32.39,21.88) v3(32.45,21.97) ; MPU6050.1 69.37,38.71 arc(67.92,38.42) 66.68,37.59 66.39,37.31 arc(65.57,36.07) 65.28,34.61 65.28,27.99 arc(64.99,26.53) 64.16,25.29 63.19,24.32 arc(62.83,24.08) BUZZER.1
  Top Layer w0.559: UART2.1 UART0#2.1
  Top Layer w0.61: H3.4 H3.3 27.41,43.91 arc(26.17,43.08) 24.71,42.79 v1(24,42.79) 7.76,42.79 arc(6.93,42.63) 6.22,42.16 arc(5.52,41.69) 4.69,41.52 3.09,41.52 arc(1.89,41.03) 1.4,39.83 1.4,26.66 arc(2.03,25.14) 3.56,24.5 10.29,24.5 arc(11.1,24.17) 11.43,23.36 JY901S.2 11.43,9.77
  Bottom Layer w0.406: v2(35.94,4.95) 36.67,4.22 arc(37.9,3.4) 39.36,3.11 H1.1 ; v3(32.45,21.97) 31.66,22.75 arc(30.42,23.58) 28.96,23.87 13.42,23.87 arc(12.75,23.74) 12.19,23.36 11.52,22.69 arc(11.45,22.59) JY901S.2 ; v2(24,6.09) MSP-LITO-G3507.1
  Bottom Layer w0.61: H3.4 30.99,44.96 31.83,45.8 31.83,45.8 arc(32.73,46.39) 33.78,46.6 69.59,46.6 arc(72.28,45.49) 73.4,42.79 MPU6050.1 75.47,36.64 arc(76.29,35.4) 76.58,33.94 76.58,9.77 arc(77.06,8.61) 78.23,8.12 UART2.1 UART3.1 ; 17.62,9.68 v1(18.8,9.68) 18.83,9.65 23.62,9.65 MSP-LITO-G3507.1 ; MSP-LITO-G3507.63 v1(24,42.79) ; v1(17.5,9.68) arc(16.98,9.62) 16.49,9.44 arc(16.16,9.25) 15.86,9 15.14,8.28 arc(14.55,7.88) 13.84,7.74 arc(13.14,7.88) 12.54,8.28 11.7,9.12 arc(11.5,9.42) 11.43,9.77
5V: length 100.9
  Top Layer w0.432: UART0.B4A9 arc(33.38,6.55) 32.92,5.85 32.42,5.36 arc(31.82,4.96) 31.12,4.82 29.75,4.82 arc(29.73,4.82) v5(29.72,4.81)
  Top Layer w0.6: UART0.A4B9 v5(28.74,8.5)
  Bottom Layer w0.6: v5(28.74,8.5) 28.74,7.73 arc(28.86,7.12) 29.21,6.6 29.27,6.54 arc(29.6,6.04) 29.72,5.45 v5(29.72,4.81) 25.01,4.81 arc(24.03,4.61) v6(23.2,4.06) v6(23.2,3.04)
  Bottom Layer w0.61: H3.2 H3.1 16.89,44.95 15.94,45.9 arc(15.16,46.42) 14.25,46.6 10.72,46.6 arc(9.26,46.31) 8.03,45.49 5.18,42.64 arc(4.08,41.91) 2.79,41.65 2.41,41.65 arc(1.34,41.2) 0.89,40.13 0.89,26.85 arc(1.09,25.86) 1.65,25.01 arc(2.31,24.03) 2.54,22.87 2.54,9.31 arc(2.8,7.98) 3.56,6.85 5.23,5.17 arc(6.47,4.35) 7.93,4.06 v6(23.2,4.06)
GND:
  vias: v4(3.8,20.83) v4(3.8,19.55) v4(3.8,18.27) v4(3.8,13.85) v4(3.8,12.57) v4(3.8,11.29) v4(5.08,20.83) v4(5.08,19.55) v4(5.08,18.27) v4(5.08,13.85) v4(5.08,12.57) v4(5.08,11.29) v4(7.61,35.05) v4(7.61,33.77) v4(8.89,35.05) v4(8.89,33.77) v4(11.55,33.9) v4(12.83,33.9) v4(14.11,33.9) v4(16.5,40.01) v4(16.5,38.73) v4(16.5,37.45) v4(17.78,40.01) v4(17.78,38.73) v4(17.78,37.45) v4(18.79,46.97) v4(20.07,46.97) v4(21.35,46.97) v4(24.12,22.85) v4(24.12,21.57) v4(25.4,22.85) v4(25.4,21.57) v4(26.68,22.85) v4(26.68,21.57) v4(29.59,18.8) v4(29.59,17.52) v4(29.59,16.24) v4(32.88,34.03) v4(33.16,18.8) v4(33.16,17.52) v4(33.16,16.24) v4(34.16,34.03) v4(38.09,20.96) v4(38.09,19.68) v4(38.09,18.4) v4(38.22,45.46) v4(38.22,44.18) v4(38.47,33.65) v4(38.61,6.09) v4(39.37,20.96) v4(39.37,19.68) v4(39.37,18.4) v4(39.5,45.46) v4(39.5,44.18) v4(39.75,33.65) v4(40.3,7.13) v4(40.78,45.46) v4(40.78,44.18) v4(43.05,34.29) v4(43.05,33.01) v4(43.68,16) v4(43.68,14.72) v4(44.96,16) v4(44.96,14.72) v4(46.21,0.76) v4(47.49,0.76) v4(48.77,0.76) v4(52.31,21.97) v4(52.31,20.69) v4(52.31,19.42) v4(56.52,25.28) v4(56.52,24) v4(56.52,22.72) v4(57.39,15.75) v4(57.39,14.47) v4(57.8,25.28) v4(57.8,24) v4(57.8,22.72) v4(58.67,15.75) v4(58.92,33.41) v4(58.92,32.12) v4(58.92,30.84) v4(60.2,33.41) v4(60.2,32.12) v4(60.2,30.84) v4(60.7,43.05) v4(61.98,43.05) v4(64.51,39.12) v4(64.51,37.84) v4(64.64,43.69) v4(64.64,42.41) v4(65,6.47) v4(65.79,39.12) v4(65.79,37.84) v4(66.28,6.47) v4(67.56,6.47) v4(68.44,15.49) v4(68.44,14.21) v4(69.71,44.2) v4(69.71,42.92) v4(69.71,41.64) v4(69.72,15.49) v4(69.72,14.21) v4(70.99,44.2) v4(70.99,42.92) v4(70.99,41.64) v4(71,15.49) v4(71,14.21) v4(72.12,3.93) v4(73.4,3.93) v4(74.68,3.93) v4(77.98,22.61) v4(77.98,21.33) v4(77.98,20.05) v4(79.26,22.61) v4(79.26,21.33) v4(79.26,20.05)
BUZZER: length 6.7
  Top Layer w0.254: v4(59.56,17.77) R12.1
  Bottom Layer w0.254: MSP-LITO-G3507.30 v4(59.56,17.77)
DIR.BL.IN1: length 44.4
  Top Layer w0.254: MSP-LITO-G3507.50 41.78,33.9 arc(41.41,33) 40.51,32.63 7.83,32.63 arc(7.05,32.95) 6.73,33.73 6.73,37.46 arc(6.92,38.4) 7.45,39.19 D24A-L.6
DIR.BL.IN2: length 36
  Top Layer w0.254: D24A-L.4 6.5,40.79 arc(7.74,41.61) 9.2,41.9 34.23,41.9 arc(35.22,41.71) v4(36.07,41.14)
  Bottom Layer w0.254: MSP-LITO-G3507.51 36.07,41.14 ; 36.07,41.14 arc(36.07,41.14) v4(36.07,41.14)
DIR.BR.IN1: length 51.7
  Top Layer w0.254: D24A-R.5 8.79,27.14 arc(10.03,26.32) 11.48,26.03 13.71,26.03 arc(14.54,26.19) 15.24,26.66 15.62,27.05 arc(16.32,27.51) 17.15,27.68 49.53,27.68 arc(51.06,28.31) 51.69,29.84 51.69,30.88 arc(51.76,31.21) v4(51.94,31.49)
  Bottom Layer w0.254: v4(51.94,31.49) 51.94,35.43
DIR.BR.IN2: length 52
  Top Layer w0.254: D24A-R.3 6.22,28.7 arc(6.79,29.07) 7.45,29.2 46.77,29.2 arc(47.73,29.6) 48.13,30.57 48.13,35.85 arc(48.27,36.52) 48.64,37.08 49.31,37.75 arc(49.38,37.85) MSP-LITO-G3507.43 ; 5.23,28.09 5.08,27.93
DIR.FL.IN1: length 47.9
  Bottom Layer w0.254: MSP-LITO-G3507.44 49.4,32.12 arc(49.07,31.32) 48.26,30.98 20.69,30.98 arc(19.53,31.21) 18.54,31.87 15.87,34.54 arc(15.17,35.01) 14.35,35.17 11.48,35.17 arc(10.03,35.46) 8.79,36.29 8.09,36.99 arc(8.02,37.09) D24A-L.5 ; 7.71,36.99 arc(7.64,37.09) 7.62,37.2
DIR.FL.IN2: length 50.5
  Top Layer w0.254: D24A-L.3 5.46,33.27 arc(5.8,32.46) 6.6,32.12 44.45,32.12 arc(45.26,32.46) 45.59,33.27 45.59,35.98 arc(45.73,36.64) 46.1,37.2 46.86,37.97 arc(46.86,37.97) MSP-LITO-G3507.45
DIR.FR.IN1: length 55.6
  Bottom Layer w0.254: 7.62,30.47 7.89,30.74 arc(8.12,30.79) 8.32,30.92 8.76,31.36 arc(9.5,31.9) 10.36,32.2 arc(10.63,32.24) 10.91,32.25 15.62,32.25 arc(16.56,32.07) 17.36,31.53 17.78,31.11 arc(19.05,30.26) 20.54,29.97 55.88,29.97 arc(56.69,30.3) 57.02,31.11 57.02,34.99 57,35.01 57,35.41 MSP-LITO-G3507.38
DIR.FR.IN2: length 59.3
  Bottom Layer w0.254: MSP-LITO-G3507.39 54.48,37.94 54.83,37.59 54.87,37.59 55.21,37.24 arc(55.61,36.64) 55.75,35.94 55.75,31.49 arc(55.46,30.77) 54.74,30.47 20.61,30.47 arc(19.29,30.74) 18.16,31.49 17.79,31.86 arc(16.79,32.53) 15.62,32.76 9.2,32.76 arc(7.74,32.47) 6.5,31.64 5.55,30.69 arc(5.48,30.59) D24A-R.4
ENC.BL.A: length 28
  Top Layer w0.254: v4(33.53,41.14) 12.71,41.14 arc(11.88,40.98) 11.18,40.51 10.63,39.96 arc(10.56,39.86) 10.54,39.75
  Bottom Layer w0.254: MSP-LITO-G3507.53 33.53,41.14 arc(33.53,41.14) v4(33.53,41.14)
ENC.BL.B: length 31.5
  Top Layer w0.254: MSP-LITO-G3507.54 36.69,35.42 36.69,34.93 36.7,34.92 36.7,34.28 arc(36.37,33.48) 35.56,33.14 16.38,33.14 arc(15.66,33.44) 15.37,34.16 15.37,38.73 arc(15.07,39.45) 14.35,39.75 12.7,39.75
ENC.BR.A: length 49.4
  Top Layer w0.254: 10.54,27.93 11.3,27.17 arc(12.01,26.7) 12.84,26.54 13.63,26.54 arc(14.3,26.67) 14.86,27.05 15.24,27.43 arc(16.08,27.99) 17.08,28.19 49.53,28.19 arc(50.7,28.67) 51.18,29.84 51.18,30.55 arc(51.47,32.01) 52.3,33.24 MSP-LITO-G3507.40
ENC.BR.B: length 47
  Top Layer w0.254: 51.94,37.97 arc(51.92,37.85) 51.85,37.75 51.18,37.08 arc(50.81,36.52) 50.67,35.85 50.67,29.84 arc(50.34,29.03) 49.53,28.7 14.92,28.7 arc(13.92,28.5) D24A-R.9
ENC.FL.A: length 43.6
  Bottom Layer w0.254: MSP-LITO-G3507.47 45.14,37.15 arc(45.48,36.65) 45.59,36.06 45.59,32.63 arc(45.26,31.82) 44.45,31.49 20.76,31.49 arc(19.77,31.69) 18.92,32.25 16.28,34.9 arc(15.41,35.48) 14.39,35.68 12.84,35.68 arc(12.01,35.85) 11.3,36.32 10.63,36.99 arc(10.56,37.09) 10.54,37.2
ENC.FL.B: length 36.5
  Bottom Layer w0.254: 12.7,37.2 13.83,37.2 arc(14.66,37.04) 15.37,36.57 19.31,32.63 arc(20.01,32.16) 20.83,32 43.18,32 arc(43.99,32.33) 44.32,33.14 MSP-LITO-G3507.48
ENC.FR.A: length 58.5
  Bottom Layer w0.254: MSP-LITO-G3507.34 62.1,30.6 arc(61.77,29.79) 60.96,29.46 20.47,29.46 arc(18.81,29.79) 17.4,30.73 17.01,31.12 arc(16.32,31.58) 15.49,31.74 12.22,31.74 arc(11.73,31.64) 11.3,31.36 10.63,30.69 arc(10.56,30.59) 10.54,30.47 ; 10.16,30.47 arc(10.18,30.59) 10.25,30.69
ENC.FR.B: length 65.3
  Bottom Layer w0.254: 12.7,30.47 13.08,30.86 15.62,30.86 arc(16.44,30.69) 17.14,30.23 17.14,30.22 arc(18.55,29.28) 20.21,28.95 61.98,28.95 arc(63.05,29.4) 63.5,30.47 63.5,37.97 arc(63.05,39.04) 61.98,39.49 61.55,39.49 arc(60.89,39.36) 60.32,38.98 59.74,38.4 arc(59.61,38.2) MSP-LITO-G3507.35
I2C0.SCL: length 47.9
  Top Layer w0.305: MSP-LITO-G3507.56 34.9,36.16 arc(35.29,36.76) 35.43,37.46 35.43,38.6 arc(35.77,39.41) 36.58,39.75 v4(57.02,39.75)
  Bottom Layer w0.254: v4(57.02,39.75) 57.43,40.15 arc(58.67,40.98) 60.12,41.27 65.66,41.27 arc(67.28,40.6) 67.94,38.98 67.94,37.39 arc(68.24,35.93) 69.06,34.69 IIC.1 73.34,33.65 arc(73.37,33.64) MPU6050.3
I2C0.SDA: length 48.2
  Top Layer w0.305: MSP-LITO-G3507.55 34.16,39.49 arc(34.46,40.21) 35.18,40.51 v4(61.21,40.51)
  Bottom Layer w0.305: v4(61.21,40.51) 65.66,40.51 arc(66.74,40.06) 67.18,38.98 67.18,35.61 arc(67.47,34.15) 68.3,32.91 IIC.2 73.34,31.11 arc(73.37,31.1) MPU6050.4
I2C1.SCL: length 66.2
  Bottom Layer w0.305: MSP-LITO-G3507.11 arc(36.89,9.09) 37.42,8.29 40,5.72 arc(40.99,5.05) 42.16,4.82 73.53,4.82 arc(75.06,5.45) 75.69,6.98 75.69,14.8 arc(75.4,16.26) 74.58,17.49 72.62,19.45 arc(71.79,20.69) 71.5,22.15 71.5,26.15 arc(71.34,26.98) 70.87,27.68 70.19,28.35 arc(70.13,28.45) IIC.3
I2C1.SDA: length 64.3
  Bottom Layer w0.305: IIC.4 70.1,22.65 arc(70.39,21.2) 71.22,19.96 74.07,17.11 arc(74.8,16.02) 75.06,14.73 75.06,6.98 arc(74.61,5.9) 73.53,5.45 42.05,5.45 arc(41.22,5.62) 40.51,6.09 38.48,8.12 arc(38.11,8.68) 37.97,9.35 37.97,10.41 arc(37.81,11.23) 37.34,11.93 MSP-LITO-G3507.12
LED: length 19.5
  Top Layer w0.305: 69.34,2.81 69.34,7.11 arc(68.91,8.15) 67.87,8.58 59.51,8.58 arc(58.55,8.77) 57.75,9.3 MSP-LITO-G3507.27 ; 69.34,2.81 arc(69.35,2.8) LED.2 ; 69.34,2.81 arc(69.35,2.8) LED.2 ; LED1.2 LED.2
PA7: length 21.6
  Top Layer w0.254: H1.4 49.91,3.83 arc(48.67,4.66) 47.21,4.95 46.1,4.95 arc(45.02,5.39) 44.58,6.47 44.58,7.23 arc(44.28,7.95) 43.56,8.25 39.5,8.25 arc(38.42,8.7) 37.97,9.77 37.97,10.15 arc(37.64,10.96) 36.83,11.3 36.15,11.3 arc(35.49,11.43) 34.93,11.81 34.16,12.56 arc(34.16,12.57) MSP-LITO-G3507.10
PA15: length 8.4
  Top Layer w0.254: H2.10 65.87,43.32 arc(65.58,41.86) 64.76,40.62 MSP-LITO-G3507.33
PA25: length 20.3
  Bottom Layer w0.254: H2.7 55.18,41.88 arc(53.94,41.05) 52.48,40.76 42.93,40.76 arc(42.12,40.43) 41.78,39.62 MSP-LITO-G3507.49
PA28: length 26
  Bottom Layer w0.254: H2.5 51.11,42.89 arc(49.88,42.07) 48.42,41.78 32.77,41.78 arc(31.96,41.44) 31.62,40.63 MSP-LITO-G3507.57
PA29: length 28
  Bottom Layer w0.254: H2.4 50.63,44.95 49.08,43.41 49.08,43.4 arc(47.85,42.57) 46.39,42.28 31.62,42.28 arc(30.72,41.91) 30.35,41.02 30.35,37.33 arc(30.47,36.75) 30.8,36.25 31.62,35.43
PA30: length 24
  Bottom Layer w0.254: H2.3 47.05,43.91 arc(45.81,43.08) 44.35,42.79 30.35,42.79 arc(29.45,42.42) 29.08,41.52 MSP-LITO-G3507.59
PA31: length 24.2
  Bottom Layer w0.254: H2.2 45.55,44.94 45.02,44.42 45.02,44.42 44.8,44.2 arc(43.8,43.53) 42.63,43.3 28.07,43.3 arc(26.99,42.85) 26.54,41.78 26.54,37.97
PB0: length 25.3
  Bottom Layer w0.254: H1.2 45.44,3.11 45.44,2.99 44.19,1.75 arc(42.96,0.92) 41.5,0.63 34.42,0.63 arc(33.34,1.08) 32.89,2.15 32.89,10.53 arc(32.75,11.24) 32.35,11.84 MSP-LITO-G3507.8
PB1: length 17.3
  Top Layer w0.254: MSP-LITO-G3507.9 35.59,8.86 arc(36.83,8.03) 38.28,7.74 43.43,7.74 arc(43.88,7.56) 44.07,7.11 44.07,6.34 arc(44.63,5) 45.97,4.44 46.23,4.44 arc(46.72,4.34) 47.13,4.06 H1.3
PB4: length 17.4
  Top Layer w0.254: H1.5 51.94,4.34 arc(50.7,5.16) 49.24,5.45 46.1,5.45 arc(45.38,5.75) 45.09,6.47 45.09,7.23 arc(44.64,8.31) 43.56,8.76 41.23,8.76 arc(40.57,8.89) 40,9.27 39.25,10.03 arc(39.24,10.03) MSP-LITO-G3507.13
PB5: length 32.8
  Top Layer w0.254: H1.6 53.97,4.85 arc(52.73,5.67) 51.28,5.96 46.23,5.96 arc(45.78,6.15) 45.59,6.6 45.59,15.61 arc(45.07,16.87) 43.81,17.39 39.75,17.39 arc(39.21,17.17) 38.99,16.63 38.99,12.82 arc(39.06,12.64) MSP-LITO-G3507.14
PB6: length 15.6
  Top Layer w0.254: H1.7 56,5.36 arc(54.77,6.18) 53.31,6.47 48.1,6.47 arc(47.23,6.83) 46.86,7.71 MSP-LITO-G3507.19
PB7: length 19.6
  Top Layer w0.254: H1.8 58.03,5.86 arc(56.8,6.69) 55.34,6.98 49.4,6.98 arc(48.5,7.35) 48.13,8.25 48.13,10.45 arc(48,11.12) 47.62,11.68 46.96,12.35 arc(46.89,12.45) MSP-LITO-G3507.20
PB10: length 15.1
  Top Layer w0.254: H1.9 60.07,6.37 arc(58.83,7.2) 57.37,7.49 53.09,7.49 arc(52.28,7.82) 51.94,8.63 51.94,10.03
PB11: length 19
  Top Layer w0.254: H1.10 62.1,6.88 arc(60.86,7.71) 59.4,8 54.49,8 arc(53.59,8.37) 53.21,9.27 53.21,10.58 arc(53.08,11.24) 52.71,11.81 51.94,12.56 arc(51.94,12.57) 51.94,12.57
PB17: length 11.4
  Top Layer w0.254: MSP-LITO-G3507.37 57.02,38.32 57.66,38.95 arc(58.25,39.35) 58.96,39.49 60.64,39.49 arc(61.64,39.69) 62.48,40.25 arc(63.14,41.24) 63.37,42.4 63.37,44.85 arc(63.36,44.91) H2.9
PB24: length 19.2
  Bottom Layer w0.254: H2.8 57.21,41.37 arc(55.97,40.54) 54.51,40.25 49.28,40.25 arc(48.47,39.92) 48.13,39.11 48.13,37.54 arc(48,36.88) 47.62,36.32 46.97,35.67 46.95,35.67 46.95,35.64 arc(46.89,35.54) MSP-LITO-G3507.46
PB27: length 22.3
  Bottom Layer w0.254: MSP-LITO-G3507.52 39.24,35.44 39.96,36.16 39.98,36.16 arc(40.37,36.76) 40.51,37.46 40.51,39.87 arc(40.92,40.86) 41.91,41.27 50.45,41.27 arc(51.91,41.56) 53.15,42.39 H2.6
S: length 17.6
  Top Layer w0.305: v4(23.11,8.38) 23.31,8.38 arc(24.74,8.65) 25.96,9.45 arc(25.98,9.47) 26,9.49 26.54,10.03 ; v4(15.49,6.98) 14.93,6.41 arc(14.78,6.31) C5.2 arc(14.55,6.24) 14.48,6.23 R11.1 13.08,4.34 arc(12.98,3.85) S/A2.1
  Bottom Layer w0.305: v4(15.49,6.98) 15.78,7.26 arc(17.01,8.09) 18.47,8.38 v4(23.11,8.38)
TIMA0.PWM0: length 78.4
  Bottom Layer w0.254: MSP-LITO-G3507.21 50.23,10.85 arc(50.56,11.35) 50.67,11.93 50.67,24.25 arc(50.23,25.33) 49.15,25.78 3.03,25.78 arc(2.1,26.16) 1.71,27.09 1.71,38 arc(1.84,38.61) 2.19,39.14 2.7,39.66 arc(2.8,39.72) D24A-L.2
TIMA0.PWM1: length 71.1
  Top Layer w0.254: MSP-LITO-G3507.22 49.4,25.65 arc(48.96,26.73) 47.88,27.17 17.27,27.17 arc(16.57,27.03) 15.97,26.63 15.62,26.28 arc(14.78,25.72) 13.78,25.52 5.74,25.52 arc(4.65,25.98) 4.19,27.07 4.19,35.43 arc(4.1,35.9) 3.83,36.29 D24A-L.1
TIMA0.PWM2: length 70.6
  Bottom Layer w0.254: MSP-LITO-G3507.25 55.22,10.76 arc(55.61,11.36) 55.75,12.06 55.75,25.27 arc(55.31,26.34) 54.23,26.79 17.95,26.79 arc(16.62,27.06) 15.49,27.81 15.02,28.28 arc(14,28.96) 12.79,29.2 4.91,29.2 arc(4.25,29.34) 3.68,29.71 D24A-R.2
TIMA0.PWM3: length 65.6
  Bottom Layer w0.254: MSP-LITO-G3507.26 54.48,24.89 arc(54.07,25.87) 53.09,26.28 5.47,26.28 arc(4.64,26.45) 3.94,26.92 3.19,27.66 arc(2.89,27.86) 2.54,27.93
UART0.RX: length 55
  Top Layer w0.203: 37.89,0.87 38.44,1.42 arc(38.69,1.59) 38.99,1.64 39.75,1.64 arc(40.29,1.87) 40.51,2.41 40.51,6.09 arc(40.81,6.81) 41.53,7.11 v4(42.67,7.11)
  Top Layer w0.305: v4(42.16,14.6) 39.83,14.6 arc(39.77,14.62) R7.1
  Bottom Layer w0.203: MSP-LITO-G3507.18 43.59,11.84 arc(43.19,11.24) 43.05,10.53 43.05,8.03 arc(42.95,7.53) v4(42.67,7.11)
  Bottom Layer w0.305: UART0#2.3 69.19,9.24 arc(67.95,8.41) 66.49,8.12 46.99,8.12 arc(46,8.53) 45.59,9.52 45.59,10.53 arc(45.45,11.24) 45.05,11.84 MSP-LITO-G3507.18 arc(44.2,12.59) 44.1,12.66 v4(42.16,14.6)
UART0.TX: length 54.2
  Top Layer w0.203: v4(42.67,6.22) 41.91,6.22 arc(41.28,5.96) 41.02,5.33 41.02,1.64 arc(40.8,1.1) 40.25,0.87 39.28,0.87
  Top Layer w0.305: R6.1 41.4,16.12 arc(42.57,15.64) 43.05,14.47 43.05,12.14 arc(43.19,11.48) 43.56,10.92 44.24,10.24 arc(44.3,10.14) MSP-LITO-G3507.17
  Bottom Layer w0.203: v4(42.67,6.22) 43.05,6.22 arc(43.5,6.4) 43.69,6.85 43.69,9.78 arc(43.76,9.96) 43.94,10.03 MSP-LITO-G3507.17
  Bottom Layer w0.305: MSP-LITO-G3507.17 44.32,8.88 arc(44.73,7.9) 45.72,7.49 68.4,7.49 arc(69.86,7.78) 71.09,8.6 UART0#2.2
UART1.RX: length 49.1
  Bottom Layer w0.305: JY901S.4 6.35,23.74 arc(6.79,24.79) 7.84,25.23 39.37,25.23 arc(40.86,24.61) 41.48,23.12 41.48,12.87 MSP-LITO-G3507.16
UART1.TX: length 47.6
  Bottom Layer w0.305: JY901S.3 8.89,23.36 arc(9.26,24.25) 10.15,24.62 38.87,24.62 arc(40.03,24.14) 40.51,22.98 40.51,12.02 arc(40.65,11.35) 41.02,10.79 41.02,10.79 41.78,10.03 41.78,10.03 arc(41.78,10.03) MSP-LITO-G3507.15
UART2.RX: length 26.2
  Top Layer w0.305: UART2.3 76.19,16.15 arc(74.95,16.98) 73.49,17.27 63.88,17.27 arc(62.71,17.03) 61.71,16.37 61.59,16.25 arc(61.03,15.41) 60.83,14.41 60.83,12.19 arc(60.67,11.37) 60.21,10.67 MSP-LITO-G3507.29
UART2.TX: length 33.2
  Top Layer w0.305: 61.24,16.78 57.02,12.57 ; UART2.2 80.03,11.55 arc(80.77,12.66) 81.03,13.96 81.03,16.12 arc(80.51,17.38) 79.25,17.9 63.93,17.9 arc(62.47,17.61) 61.24,16.78
UART3.RX: length 30.4
  Top Layer w0.305: MSP-LITO-G3507.31 68.7,10.03 arc(69.6,9.66) 69.98,8.76 69.98,6.85 arc(70.5,5.59) 71.75,5.07 81.66,5.07 arc(82.92,5.59) 83.44,6.85 83.44,7.71 arc(83.67,8.88) 84.34,9.88 UART3.2
UART3.TX: length 34.3
  Top Layer w0.305: UART3.3 83.59,11.67 arc(83.01,10.8) 82.8,9.77 82.8,6.98 arc(82.43,6.08) 81.53,5.71 71.75,5.71 arc(70.95,6.04) 70.61,6.85 70.61,11.17 arc(70.2,12.16) 69.22,12.57 62.11,12.57 arc(62.1,12.57) MSP-LITO-G3507.32
UD+: length 11.9
  Top Layer w0.299: UART0.B6 31.89,6.71 arc(31.75,6.36) 31.39,6.21 arc(31.04,6.36) 30.89,6.72 UART0.A6
  Top Layer w0.305: UART0.B6 31.89,8.05 arc(31.95,8.36) v4(32.13,8.63)
  Bottom Layer w0.305: v4(29.37,14.77) 29.63,14.51 arc(30.16,13.71) 30.35,12.76 30.35,9.95 arc(30.74,9.02) 31.67,8.63 v4(32.13,8.63)
UD-: length 9.6
  Top Layer w0.299: UART0.A7 31.39,8.25 arc(31.24,8.61) 30.88,8.76 30.42,8.76 arc(30.4,8.76) 30.39,8.78 ; 30.39,8.78 30.39,14.75 arc(30.38,14.76) CH340K.2 ; 30.39,8.78 UART0.B7
$1N4922: length 1.4
  Top Layer w0.305: PWR#2.2 6.57,46.11 arc(6.58,46.17) R3.1
$1N4923: length 3.1
  Top Layer w0.355: 18.49,5.46 18.49,5.46 17.21,5.46 16.92,5.75 ; 16.92,5.75 R2.2 ; 16.92,5.75 R1.1
$1N4924: length 4
  Top Layer w0.6: 21.09,5.36 20.42,5.36 arc(19.99,5.53) 19.81,5.96 19.81,6.6 arc(19.62,7.06) 19.15,7.26 TLV.4
$1N5756: length 7.2
  Top Layer w0.299: UART0.B5 32.89,7.99 arc(33.08,8.44) 33.53,8.63 v4(34.29,8.63) ; R4.2 v4(36.58,6.7)
  Bottom Layer w0.299: v4(36.58,6.7) 36.58,7.49 arc(36.24,8.3) 35.43,8.63 v4(34.29,8.63)
$1N5757: length 6.1
  Top Layer w0.299: UART0.A5 29.89,6.73 arc(29.48,5.74) 28.49,5.33 25.36,5.33 arc(25.3,5.3) R5.2
$1N5901: length 17.5
  Top Layer w0.355: R6.2 37.85,16.12 arc(37.13,16.42) 36.83,17.14 36.83,22.09 arc(36.27,23.44) 34.93,24 32.13,24 arc(30.89,23.48) 30.37,22.23 CH340K.9
$1N5929: length 16.9
  Top Layer w0.355: CH340K.8 31.37,22.09 arc(31.7,22.9) 32.51,23.23 34.93,23.23 arc(35.73,22.9) 36.07,22.09 36.07,15.74 arc(36.38,14.99) 37.13,14.68 R7.2
$1N6046: length 1.7
  Top Layer w0.6: C4.1 29.1,20 arc(29.29,20.08) CH340K.10
$1N7352: length 1.3
  Top Layer w0.305: →Rx.2 37.89,3.75 arc(37.89,3.76) 37.88,3.77
$1N7353: length 1.3
  Top Layer w0.305: 39.26,3.77 39.26,2.49 arc(39.27,2.48) ←Tx.2
$1N7360: length 1.8
  Top Layer w0.254: R12.2 54.97,17.77 arc(54.85,17.82) Q1.1
$1N7363: length 8.4
  Top Layer w0.355: Q1.3 53.85,23.56 arc(53.72,23.87) BUZZER.2
$1N7370: length 1.5
  Top Layer w0.305: LED.1 72.44,2.8 arc(72.44,2.8) R10.1
$1N18211: length 1.5
  Top Layer w0.305: LED1.1 72.44,1.26 arc(72.45,1.26) R13.1

## Copper pours and planes (outline as drawn; the poured copper is in the pictures)
3V3 on Top Layer: 19.18,11.17 19.3,11.04 19.3,8.38 19.05,8.12 16.51,8.12 16.38,8.25 16.38,10.28 16.51,10.41 17.4,10.41 17.78,10.79 17.78,11.04 17.91,11.17
GND on Top Layer: -1.78,51.17 91.31,51.17 91.31,-1.28 -1.78,-1.28
GND on Bottom Layer: -1.78,51.05 91.06,51.05 91.06,-1.4 -1.78,-1.4
$1N4920 on Top Layer: 20.45,6.98 20.45,11.04 20.57,11.17 21.84,11.17 21.97,11.04 21.97,8.25 21.72,8 21.72,6.98 21.64,6.91 20.52,6.91
$1N4924 on Top Layer: 22.1,2.53 22.1,4.44 22.48,4.82 23.11,4.82 23.24,4.95 23.24,5.71 23.11,5.84 21.97,5.84 21.79,5.66 20.57,5.66 20.57,5.07 20.83,5.07 21.34,4.57 21.34,2.53

Small or netless copper shapes (teardrops, artwork), in the pictures only: 122 on Top Layer, 92 on Bottom Layer

## Text on the board
Bottom Silkscreen Layer: v1.0 | Designed By WilliTourt | NUEDC | TI-2025 Controller Platform
Document Layer: >>FORWARD>> | >>
Top Silkscreen Layer: GND | 5V | 3V3 | A31 | A30 | A29 | A28 | B27 | A25 | B24 | B17 | A15 | B00 | B01 | A07 | B04 | B05 | B06 | B07 | B10 | B11 | SCL0 | SDA0 | SCL1 | SDA1 | RX | TX | μVisionの0Error G.O.D.
